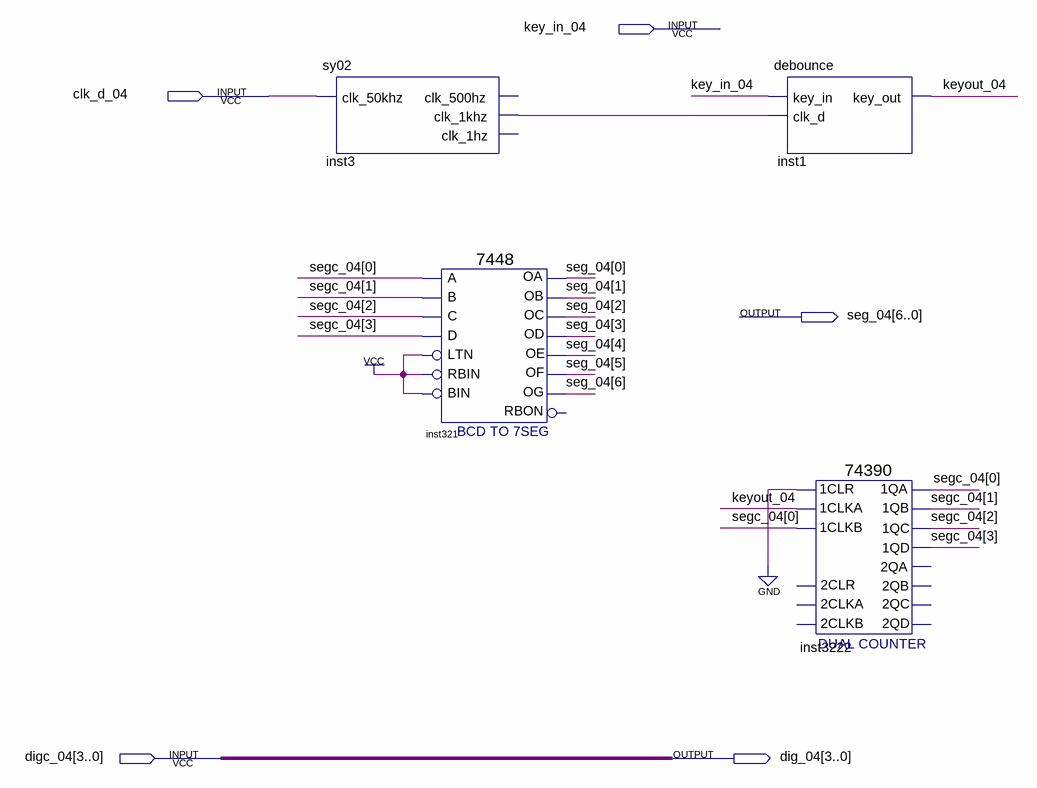
[diagram p0: schematic sheet]
// Quartus schematic sy03_04.bdf as structural Verilog: 4 symbols, 5 pins
module sy03_04 (
  input  key_in_04,
  input  clk_d_04,
  input  [3:0] digc_04,
  output [6:0] seg_04,
  output [3:0] dig_04
);

  wire inst3_clk_1khz, keyout_04;
  wire [3:0] segc_04;

  sy02 inst3 (.clk_50khz(clk_d_04), .clk_1khz(inst3_clk_1khz));  // open: clk_500hz, clk_1hz
  \7448  inst321 (
    .A(segc_04[0]), .C(segc_04[2]), .D(segc_04[3]), .B(segc_04[1]), .RBIN(1'b1), .BIN(1'b1), .LTN(1'b1),
    .OC(seg_04[2]), .OE(seg_04[4]), .OD(seg_04[3]), .OF(seg_04[5]), .OG(seg_04[6]), .OB(seg_04[1]),
    .OA(seg_04[0]));  // open: RBON
  debounce inst1 (.key_in(key_in_04), .clk_d(inst3_clk_1khz), .key_out(keyout_04));
  \74390  inst3222 (
    .\1CLR (1'b0), .\1CLKA (keyout_04), .\1CLKB (segc_04[0]), .\1QA (segc_04[0]), .\1QB (segc_04[1]),
    .\1QC (segc_04[2]), .\1QD (segc_04[3]));  // open: 2CLKA, 2CLR, 2CLKB, 2QA, 2QB, 2QC, 2QD

  assign dig_04 = digc_04;
endmodule
